# Altium schematic sheet AF SS-JB17.6.schdoc
size 127 x 101 mm
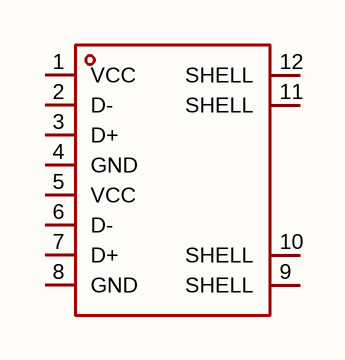
[diagram p0: AF SS-JB17.6.schdoc]

## Parts
USB?  af ss-jb17.6  [USB-A-TH_AF-SS-JB17.6]  (value not drawn)

## Nets

Not connected (* = marked no-connect by the designer): USB? 1(VCC) 2(D-) 3(D+) 4(GND) 5(VCC) 6(D-) 7(D+) 8(GND) 9(SHELL) 10(SHELL) 11(SHELL) 12(SHELL)

## Library data of the parts
USB? = af ss-jb17.6: 连接器类型:Type-A;协议标准:USB 2.0;公母:母;安装方式:弯插;触点数量:4Px2;端口数量:2;额定电流 - 电源:1.5A;工作温度:-25℃~+85℃;; Manufacturer: SHOU HAN(首韩); AddInBom: yes; ModelId: 8ba1d227017a431299b02e84e92b305a; ModelTransform: 633.987,692.912,0,0,0,0,0.001,-157.952,-157.48; Connector Type: Type-A; Protocol Standard: USB 2.0; Gender: 母; Number of Contacts: 4Px2; Number of Ports: 2; Current Rating-Power: 1.5A; Voltage Rating: 30V; Connect-Disconnect Life: 5千次; Detection color: 白色; Symbol: AF SS-JB17.6; LCSC Part Name: Type-A弯插双层母座; SupplierPart: C456021; ManufacturerPart: AF SS-JB17.6; Supplier Footprint: 弯插; JLCPCB Part Class: Extended Part; Datasheet: https://item.szlcsc.com/datasheet/AF%2520SS-JB17.6/458828.html; Supplier: LCSC; ConvertToPcb: yes; FootprintName: USB-A-TH_AF-SS-JB17.6; ModelName: USB-A-TH_AF-SS-JB17.6; Mounting Type: 弯插; Supplementary Features: -; Center Height: -; Length: 17.6mm; Operating Temperature: -25℃~+85℃